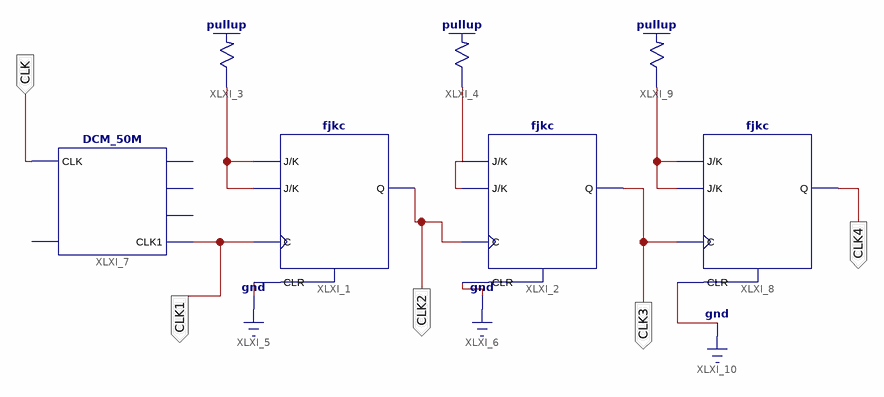
[diagram p0: schematic sheet 1]
// Xilinx ISE schematic Exp2.sch (spartan3e) as structural Verilog: 7 symbols, 5 ports
module Exp2 (
  input  CLK,
  output CLK1,
  output CLK2,
  output CLK3,
  output CLK4
);

  wire XLXN_1, XLXN_2, XLXN_15;

  fjkc XLXI_1 (.C(CLK1), .CLR(1'b0), .J(XLXN_2), .K(XLXN_2), .Q(CLK2));
  fjkc XLXI_2 (.C(CLK2), .CLR(1'b0), .J(XLXN_1), .K(XLXN_1), .Q(CLK3));
  \pullup  XLXI_3 (.O(XLXN_2));
  \pullup  XLXI_4 (.O(XLXN_1));
  DCM_50M XLXI_7 (.CLK(CLK), .CLK1(CLK1));  // open: RST, CLK1M, CLK10k, CLK1k
  fjkc XLXI_8 (.C(CLK3), .CLR(1'b0), .J(XLXN_15), .K(XLXN_15), .Q(CLK4));
  \pullup  XLXI_9 (.O(XLXN_15));
endmodule
